# Altium schematic sheet switches.SchDoc: Quad Switch
size A; Organization: Cal Poly Racing; engineer1: Graydon Wilson
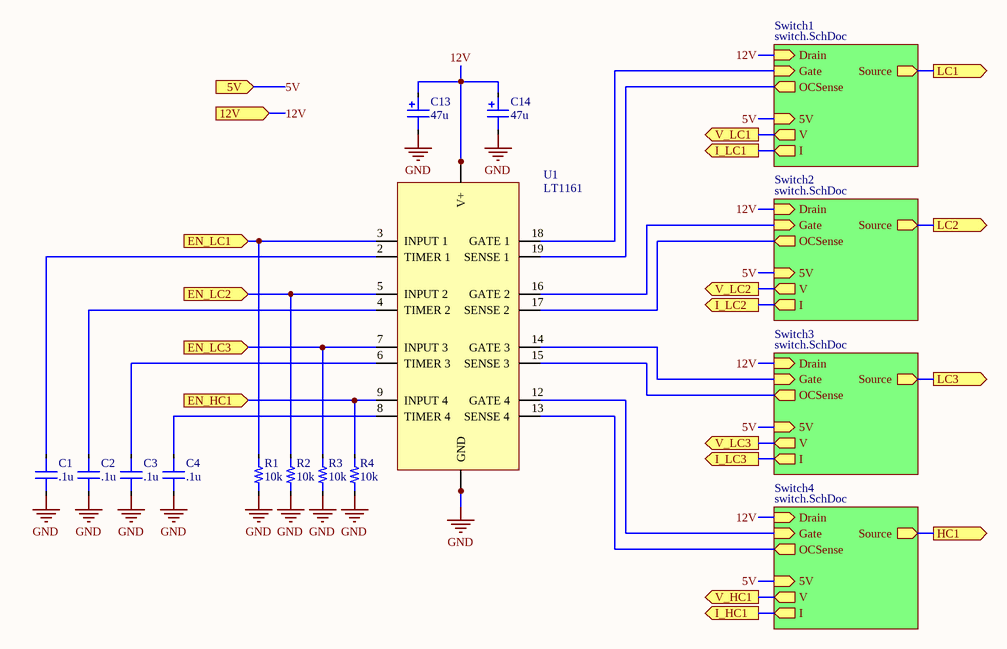
[diagram p0: switches.SchDoc]

## Parts
C1  value .1u  [0603_CAP]  (hidden comment: Capacitor)
C2  value .1u  [0603_CAP]  (hidden comment: Capacitor)
C3  value .1u  [0603_CAP]  (hidden comment: Capacitor)
C4  value .1u  [0603_CAP]  (hidden comment: Capacitor)
C13  value 47u  [CAPAE6666X77M]  (hidden comment: UWT1H470MCL1GS)
C14  value 47u  [CAPAE6666X77M]  (hidden comment: UWT1H470MCL1GS)
R1  value 10k  [0603_RES]  (hidden comment: Resistor)
R2  value 10k  [0603_RES]  (hidden comment: Resistor)
R3  value 10k  [0603_RES]  (hidden comment: Resistor)
R4  value 10k  [0603_RES]  (hidden comment: Resistor)
U1  LT1161  [SO-20]

## Sub-sheets
Switch1 = switch.SchDoc: 5V (in), I (out), V (out), OCSense (out), Gate (in), Drain (in), Source (out)
Switch2 = switch.SchDoc: 5V (in), I (out), V (out), OCSense (out), Gate (in), Drain (in), Source (out)
Switch3 = switch.SchDoc: 5V (in), I (out), V (out), OCSense (out), Gate (in), Drain (in), Source (out)
Switch4 = switch.SchDoc: 5V (in), I (out), V (out), OCSense (out), Gate (in), Drain (in), Source (out)

## Ports
5V (in), 12V (in), EN_HC1 (in), EN_LC1 (in), EN_LC2 (in), EN_LC3 (in), HC1 (out), I_HC1 (out), I_LC1 (out), I_LC2 (out), I_LC3 (out), LC1 (out), LC2 (out), LC3 (out), V_HC1 (out), V_LC1 (out), V_LC2 (out), V_LC3 (out)

## Nets
GND: C1.1 C2.1 C3.1 C4.1 C13.2 C14.2 R1.1 R2.1 R3.1 R4.1 U1.1(GND) U1.10(GND)
5V: port 5V, sheet Switch1/5V, sheet Switch2/5V, sheet Switch3/5V, sheet Switch4/5V
12V: C13.1 C14.1 U1.11(V+) U1.20(V+) ; port 12V, sheet Switch1/Drain, sheet Switch2/Drain, sheet Switch3/Drain, sheet Switch4/Drain
EN_HC1: R4.2 U1.9(INPUT_4) ; port EN_HC1
EN_LC1: R1.2 U1.3(INPUT_1) ; port EN_LC1
EN_LC2: R2.2 U1.5(INPUT_2) ; port EN_LC2
EN_LC3: R3.2 U1.7(INPUT_3) ; port EN_LC3
HC1: port HC1, sheet Switch4/Source
I_HC1: port I_HC1, sheet Switch4/I
I_LC1: port I_LC1, sheet Switch1/I
I_LC2: port I_LC2, sheet Switch2/I
I_LC3: port I_LC3, sheet Switch3/I
LC1: port LC1, sheet Switch1/Source
LC2: port LC2, sheet Switch2/Source
LC3: port LC3, sheet Switch3/Source
V_HC1: port V_HC1, sheet Switch4/V
V_LC1: port V_LC1, sheet Switch1/V
V_LC2: port V_LC2, sheet Switch2/V
V_LC3: port V_LC3, sheet Switch3/V
NetC1_2: C1.2 U1.2(TIMER_1)
NetC2_2: C2.2 U1.4(TIMER_2)
NetC3_2: C3.2 U1.6(TIMER_3)
NetC4_2: C4.2 U1.8(TIMER_4)
NetU1_12: U1.12(GATE_4) ; sheet Switch4/Gate
NetU1_13: U1.13(SENSE_4) ; sheet Switch4/OCSense
NetU1_14: U1.14(GATE_3) ; sheet Switch3/Gate
NetU1_15: U1.15(SENSE_3) ; sheet Switch3/OCSense
NetU1_16: U1.16(GATE_2) ; sheet Switch2/Gate
NetU1_17: U1.17(SENSE_2) ; sheet Switch2/OCSense
NetU1_18: U1.18(GATE_1) ; sheet Switch1/Gate
NetU1_19: U1.19(SENSE_1) ; sheet Switch1/OCSense

## Notes on the sheet
- Date:
- Time:
- File:

## Library data of the parts
C13 C14 = UWT1H470MCL1GS: CAP ALUM 47UF 20% 50V SMD; Dielectric: Aluminum Electrolytic; Vmax: 50; Percent Tolerance: 20%
C1-C4 = Capacitor: Dielectric: *; Percent Tolerance: *; ESR: *
R1-R4 = Resistor: Tolerance: *
U1 = LT1161: Name: LT1161; ComponentLink1Description: Datasheet; ComponentLink1URL: https://www.analog.com/media/en/technical-documentation/data-sheets/1161fa.pdf; ComponentLink2Description: Digikey; ComponentLink2URL: https://www.digikey.com/product-detail/en/linear-technology-analog-devices/LT1161ISW-PBF/LT1161ISW-PBF-ND/888528